# EAGLE design g_plus_shield_v2 (EAGLE 7.2.0)
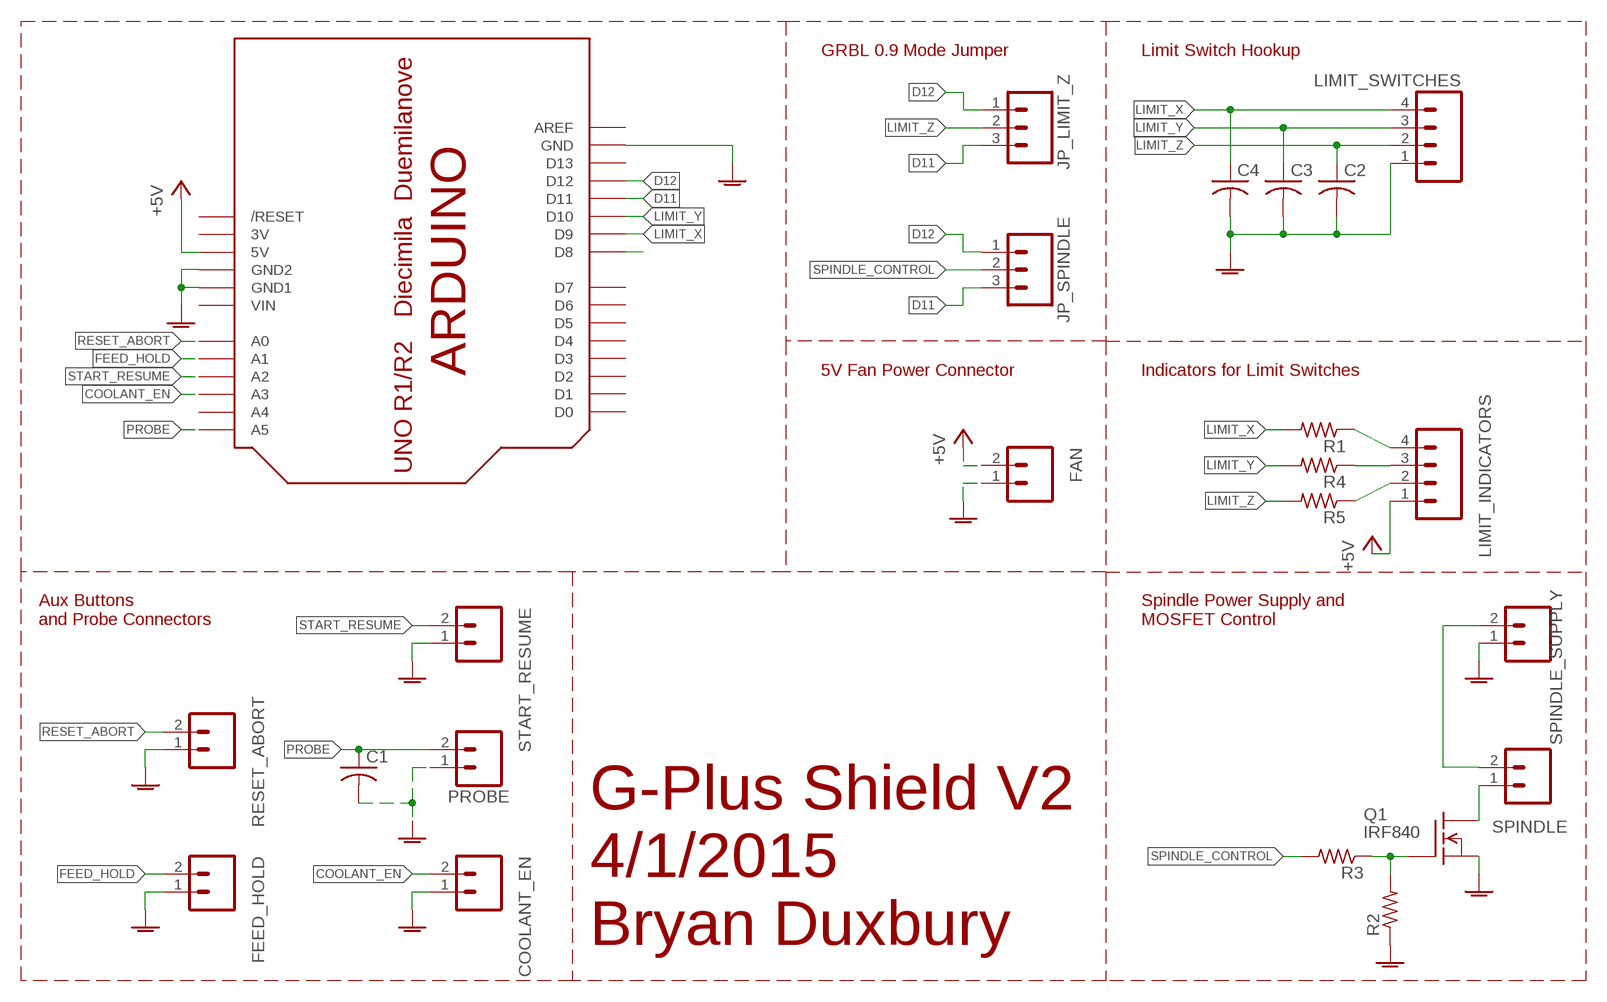
[diagram p0: schematic, sheet 1]

## Parts
C1  C-US050-024X044  [C050-024X044]
C2  C-US050-024X044  [C050-024X044]
C3  C-US050-024X044  [C050-024X044]
C4  C-US050-024X044  [C050-024X044]
COOLANT_EN  M02POLAR  [MOLEX-1X2]
FAN  M02POLAR  [MOLEX-1X2]
FEED_HOLD  M02POLAR  [MOLEX-1X2]
JP_LIMIT_Z  M03POLAR  [MOLEX-1X3]
JP_SPINDLE  M03POLAR  [MOLEX-1X3]
LIMIT_INDICATORS  M04POLAR  [MOLEX-1X4]
LIMIT_SWITCHES  M04POLAR  [MOLEX-1X4]
PROBE  M02POLAR  [MOLEX-1X2]
Q1  IRF840  [TO220]
R1  R-US_0207/7  [0207/7]
R2  R-US_0207/7  [0207/7]
R3  R-US_0207/7  [0207/7]
R4  R-US_0207/7  [0207/7]
R5  R-US_0207/7  [0207/7]
RESET_ABORT  M02POLAR  [MOLEX-1X2]
SPINDLE  M02POLAR  [MOLEX-1X2]
SPINDLE_SUPPLY  M02POLAR  [MOLEX-1X2]
START_RESUME  M02POLAR  [MOLEX-1X2]
U$1  ARDUINO-NODIM  [ARDUINO-NODIM]

## Nets
48V: SPINDLE.2 SPINDLE_SUPPLY.2
+5V: FAN.2 LIMIT_INDICATORS.1 U$1.5V
COOLANT_EN: COOLANT_EN.2 U$1.A3
D11: JP_LIMIT_Z.3 JP_SPINDLE.3 U$1.D11
D12: JP_LIMIT_Z.1 JP_SPINDLE.1 U$1.D12
FEED_HOLD: FEED_HOLD.2 U$1.A1
GNDA: C1.2 C2.2 C3.2 C4.2 COOLANT_EN.1 FAN.1 FEED_HOLD.1 LIMIT_SWITCHES.1 PROBE.1 Q1.3(S) R2.1 RESET_ABORT.1 SPINDLE_SUPPLY.1 START_RESUME.1 U$1.GND U$1.GND1 U$1.GND2
LIMIT_X: C4.1 LIMIT_SWITCHES.4 R1.2 U$1.D9
LIMIT_Y: C3.1 LIMIT_SWITCHES.3 R4.2 U$1.D10
LIMIT_Z: C2.1 JP_LIMIT_Z.2 LIMIT_SWITCHES.2 R5.2
N$1: LIMIT_INDICATORS.4 R1.1
N$2: Q1.2(D) SPINDLE.1
N$3: Q1.1(G) R2.2 R3.1
N$4: LIMIT_INDICATORS.2 R5.1
N$5: LIMIT_INDICATORS.3 R4.1
N$9: U$1.D8
PROBE: C1.1 PROBE.2 U$1.A5
RESET_ABORT: RESET_ABORT.2 U$1.A0
SPINDLE_CONTROL: JP_SPINDLE.2 R3.2
START_RESUME: START_RESUME.2 U$1.A2
Unconnected: U$1.A4 U$1.AREF U$1.D0 U$1.D1 U$1.D2 U$1.D3 U$1.D4 U$1.D5 U$1.D6 U$1.D7 U$1.D13 U$1.RESET(/RESET)

## Notes on the sheet
- GRBL 0.9 Mode Jumper | Limit Switch Hookup
- 5V Fan Power Connector | Indicators for Limit Switches
- Aux Buttons 
  and Probe Connectors
- Spindle Power Supply and 
  MOSFET Control
- G-Plus Shield V2
  4/1/2015
  Bryan Duxbury

## Power pins joined to a net without a drawn wire
3V: U$1.3V
VIN: U$1.VIN

## Library data of the parts
C1-C4 = rcl:C-US: CAPACITOR, American symbol
COOLANT_EN FAN FEED_HOLD PROBE RESET_ABORT SPINDLE SPINDLE_SUPPLY START_RESUME = SparkFun-Connectors:M02: Standard 2-pin 0.1" header. Use with - straight break away headers ( PRT-00116) - right angle break away headers (PRT-00553) - swiss pins (PRT-00743) - machine pins (PRT-00117) - female headers (PRT-00115) Molex polarized connector foot print use with: PRT-08233 with associated crimp pins and housings. 2.54_SCREWTERM for use with PRT-10571. 3.5mm Screw Terminal footprints for PRT-08084 5mm Screw Terminal footprints for use with PRT-08433
JP_LIMIT_Z JP_SPINDLE = SparkFun-Connectors:M03: Header 3 Standard 3-pin 0.1" header. Use with straight break away headers (SKU : PRT-00116), right angle break away headers (PRT-00553), swiss pins (PRT-00743), machine pins (PRT-00117), and female headers (PRT-00115). Molex polarized connector foot print use with SKU : PRT-08232 with associated crimp pins and housings.
LIMIT_INDICATORS LIMIT_SWITCHES = SparkFun-Connectors:M04: Header 4 Standard 4-pin 0.1" header. Use with straight break away headers (SKU : PRT-00116), right angle break away headers (PRT-00553), swiss pins (PRT-00743), machine pins (PRT-00117), and female headers (PRT-00115). Molex polarized connector foot print use with SKU : PRT-08231 with associated crimp pins and housings. 1MM SMD Version SKU: PRT-10208
Q1 = transistor-fet:IRF840: N-Channel Enhancement MOSFET (HEXFET); 500V; 8A; 0,85Ohm
R1-R5 = rcl:R-US_: RESISTOR, American symbol
U$1 = adafruit:ARDUINO: Arduino Diecimila/Duemilanove Make a shield with ease, this package has all the named pins as well as the two mounting drill holes and an outline of the USB and DC power connector. The outline is on the DIMENSION layer, so if your board house uses it they will cut the outline to match. http://www.ladyada.net/library/pcb/eaglelibrary.html

## Board
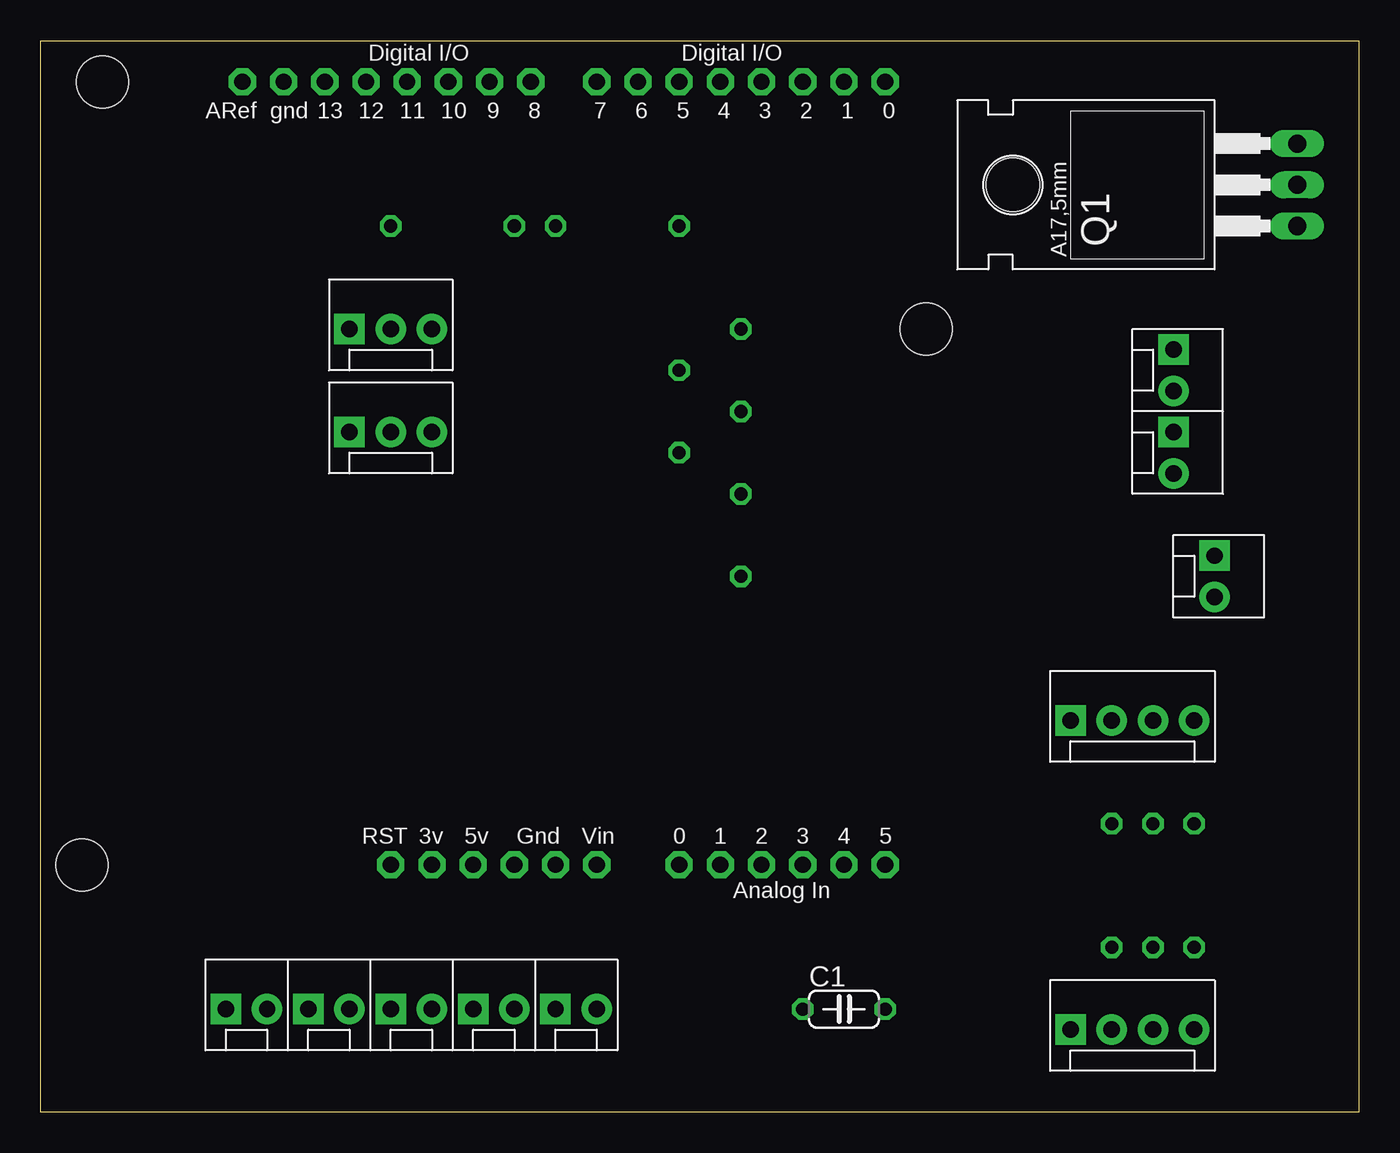
[diagram p1: board, top side]
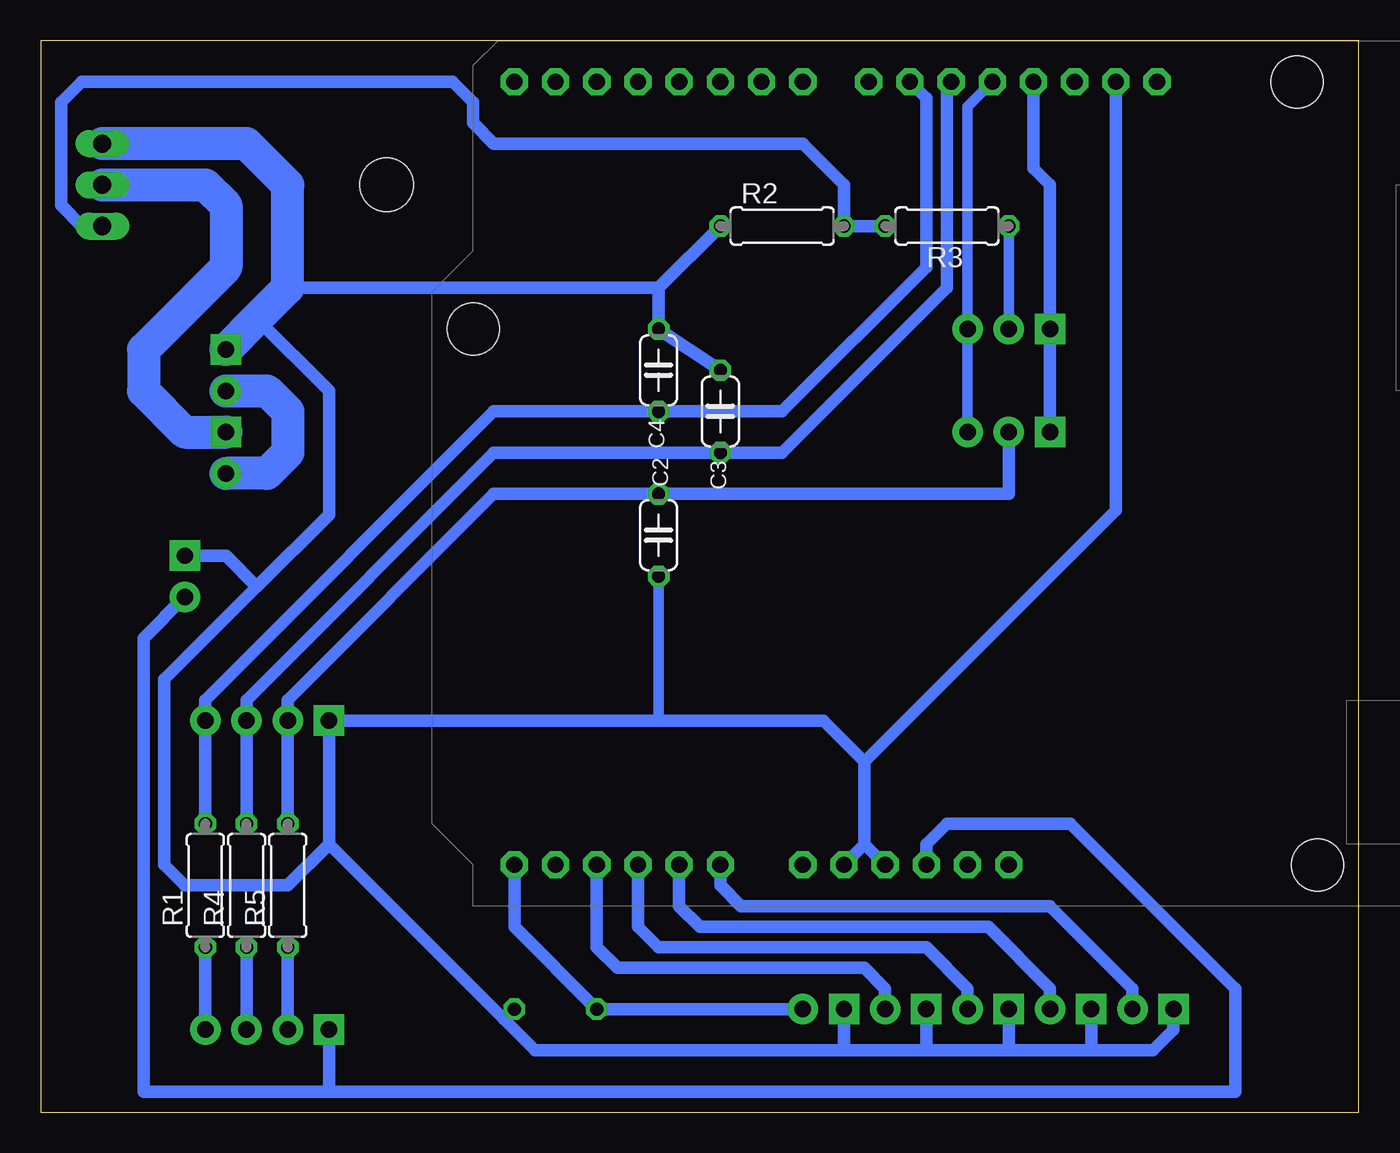
[diagram p2: board, bottom side, seen from below]

Size 81.28 x 66.04 mm. Coordinates in mm from the lower left corner, seen from the top.
Outline: 0,0 0,66.04 81.28,66.04 81.28,0 0,0
Copper layers (1*16): Top 0.035mm / dielectric 1.5mm / Bottom 0.035mm
Design rules "default *": minimum track width 15mil, minimum drill 24mil, track to track 20mil, track to pad 20mil, pad to pad 20mil, via to via 20mil, smd to smd 20mil, copper to edge 20mil, drill to drill 20mil, minimum pad ring 10mil, minimum via ring 8mil, stop-mask expansion 4mil, vias tented up to drill 0mil, thermal gap 10mil

### Footprints (pad centres in the part's own frame; a part is rotated, then mirrored left to right if it is on the bottom)
C050-024X044 = drill 0.813 octagon: 1 -2.54,0; 2 2.54,0
MOLEX-1X2 = drill 1.016 pad 1.88 square: 1 0,0 | drill 1.016 pad 1.88: 2 2.54,0
MOLEX-1X3 = drill 1.016 pad 1.88 square: 1 0,0 | drill 1.016 pad 1.88: 2 2.54,0; 3 5.08,0
MOLEX-1X4 = drill 1.016 pad 1.88 square: 1 0,0 | drill 1.016 pad 1.88: 2 2.54,0; 3 5.08,0; 4 7.62,0
TO220 = drill 1.118 long: 1 -2.54,-6.35; 2 0,-6.35; 3 2.54,-6.35 | hole 3.302: 0,11.176
0207/7 = drill 0.813 octagon: 1 -3.81,0; 2 3.81,0
ARDUINO-NODIM = drill 1 pad 1.676 octagon: 3V 35.56,2.54; 5V 38.1,2.54; A0 50.8,2.54; A1 53.34,2.54; A2 55.88,2.54; A3 58.42,2.54; A4 60.96,2.54; A5 63.5,2.54; AREF 23.876,50.8; D0 63.5,50.8; D1 60.96,50.8; D2 58.42,50.8; D3 55.88,50.8; D4 53.34,50.8; D5 50.8,50.8; D6 48.26,50.8; D7 45.72,50.8; D8 41.656,50.8; D9 39.116,50.8; D10 36.576,50.8; D11 34.036,50.8; D12 31.496,50.8; D13 28.956,50.8; GND 26.416,50.8; GND1 43.18,2.54; GND2 40.64,2.54; RESET 33.02,2.54; VIN 45.72,2.54 | hole 3.2: 15.24,50.8; 66.04,35.56; 13.97,2.54

### Placement (x,y rotation side)
C1  49.53,6.35 0 top
C2  43.18,35.56 270 bottom
C3  39.37,43.18 90 bottom
C4  43.18,45.72 90 bottom
COOLANT_EN  26.67,6.35 0 top
FAN  72.39,34.29 270 top
FEED_HOLD  16.51,6.35 0 top
JP_LIMIT_Z  19.05,41.91 0 top
JP_SPINDLE  19.05,48.26 0 top
LIMIT_INDICATORS  63.5,5.08 0 top
LIMIT_SWITCHES  63.5,24.13 0 top
PROBE  31.75,6.35 0 top
Q1  71.12,57.15 90 top
R1  71.12,13.97 90 bottom
R2  35.56,54.61 0 bottom
R3  25.4,54.61 0 bottom
R4  68.58,13.97 90 bottom
R5  66.04,13.97 90 bottom
RESET_ABORT  11.43,6.35 0 top
SPINDLE  69.85,41.91 270 top
SPINDLE_SUPPLY  69.85,46.99 270 top
START_RESUME  21.59,6.35 0 top
U$1  -11.43,12.7 0 top

### Tracks (layer width: path | path; a pad name or v marks a point on that pad's centre or on a via)
48V
  Bottom 2.032: SPINDLE_SUPPLY.2 67.31,44.45 66.04,43.18 66.04,40.64 67.31,39.37 SPINDLE.2
+5V
  Bottom 0.762: U$1.5V 26.67,16.51 25.4,17.78 17.78,17.78 7.62,7.62 7.62,1.27 63.5,1.27 | 63.5,1.27 74.93,1.27 74.93,29.21 FAN.2 | LIMIT_INDICATORS.1 63.5,1.27
COOLANT_EN
  Bottom 0.762: COOLANT_EN.2 29.21,7.62 30.48,8.89 45.72,8.89 46.99,10.16 U$1.A3
D11
  Bottom 0.635: JP_LIMIT_Z.3 JP_SPINDLE.3 24.13,61.98 U$1.D11
D12
  Bottom 0.762: JP_LIMIT_Z.1 JP_SPINDLE.1 19.05,57.15 20.07,58.17 U$1.D12
FEED_HOLD
  Bottom 0.762: FEED_HOLD.2 19.05,7.62 22.86,11.43 40.64,11.43 41.91,12.7 U$1.A1
GNDA
  Bottom 0.381: C1.2 52.7,5.71
  Bottom 0.635: C2.2 43.18,24.13
  Bottom 0.762: R2.1 43.18,50.8 | 43.18,50.8 66.04,50.8 | 67.94,48.9 63.5,44.45 63.5,36.83 67.94,32.38 | 30.48,21.59 33.02,24.13 43.18,24.13 LIMIT_SWITCHES.1 63.5,16.51 | 30.48,21.59 30.48,16.51 | 30.48,16.51 U$1.GND1 | U$1.GND2 30.48,16.51 | 43.18,50.8 C4.2 C3.2 | RESET_ABORT.1 11.43,5.08 12.7,3.81 16.51,3.81 | 16.51,3.81 21.59,3.81 | 21.59,3.81 26.67,3.81 | 26.67,3.81 31.75,3.81 | 31.75,3.81 50.8,3.81 52.7,5.71 63.5,16.51 | FEED_HOLD.1 16.51,3.81 | START_RESUME.1 21.59,3.81 | COOLANT_EN.1 26.67,3.81 | PROBE.1 31.75,3.81 | U$1.GND 14.99,37.08 30.48,21.59 | 63.5,16.51 66.04,13.97 72.39,13.97 73.66,15.24 73.66,26.67 67.94,32.38 | FAN.1 69.85,34.29 67.94,32.38
  Bottom 2.032: SPINDLE_SUPPLY.1 67.94,48.9 66.04,50.8 66.04,57.15 68.58,59.69 Q1.3
LIMIT_X
  Bottom 0.762: U$1.D9 26.67,62.48 26.67,52.07 35.56,43.18 C4.1 53.34,43.18 71.12,25.4 LIMIT_SWITCHES.4 R1.2
LIMIT_Y
  Bottom 0.762: U$1.D10 25.4,63.25 25.4,50.8 35.56,40.64 C3.1 53.34,40.64 68.58,25.4 LIMIT_SWITCHES.3 R4.2
LIMIT_Z
  Bottom 0.762: JP_LIMIT_Z.2 21.59,38.1 C2.1 53.34,38.1 66.04,25.4 LIMIT_SWITCHES.2 R5.2
N$1
  Bottom 0.762: R1.1 LIMIT_INDICATORS.4
N$2
  Bottom 2.032: Q1.2 71.12,57.15 69.85,55.88 69.85,52.07 74.93,46.99 74.93,44.45 72.39,41.91 SPINDLE.1
N$3
  Bottom 0.762: R3.1 R2.2 31.75,57.15 34.29,59.69 53.34,59.69 54.61,60.96 54.61,62.23 55.88,63.5 78.74,63.5 80.01,62.23 80.01,55.88 78.74,54.61 Q1.1
N$4
  Bottom 0.762: LIMIT_INDICATORS.2 R5.1
N$5
  Bottom 0.762: LIMIT_INDICATORS.3 R4.1
PROBE
  Bottom 0.762: PROBE.2 C1.1 52.07,11.43 U$1.A5
RESET_ABORT
  Bottom 0.762: RESET_ABORT.2 13.97,7.62 19.05,12.7 38.1,12.7 39.37,13.97 U$1.A0
SPINDLE_CONTROL
  Bottom 0.635: JP_SPINDLE.2 R3.2
START_RESUME
  Bottom 0.762: START_RESUME.2 24.13,7.62 26.67,10.16 43.18,10.16 44.45,11.43 U$1.A2